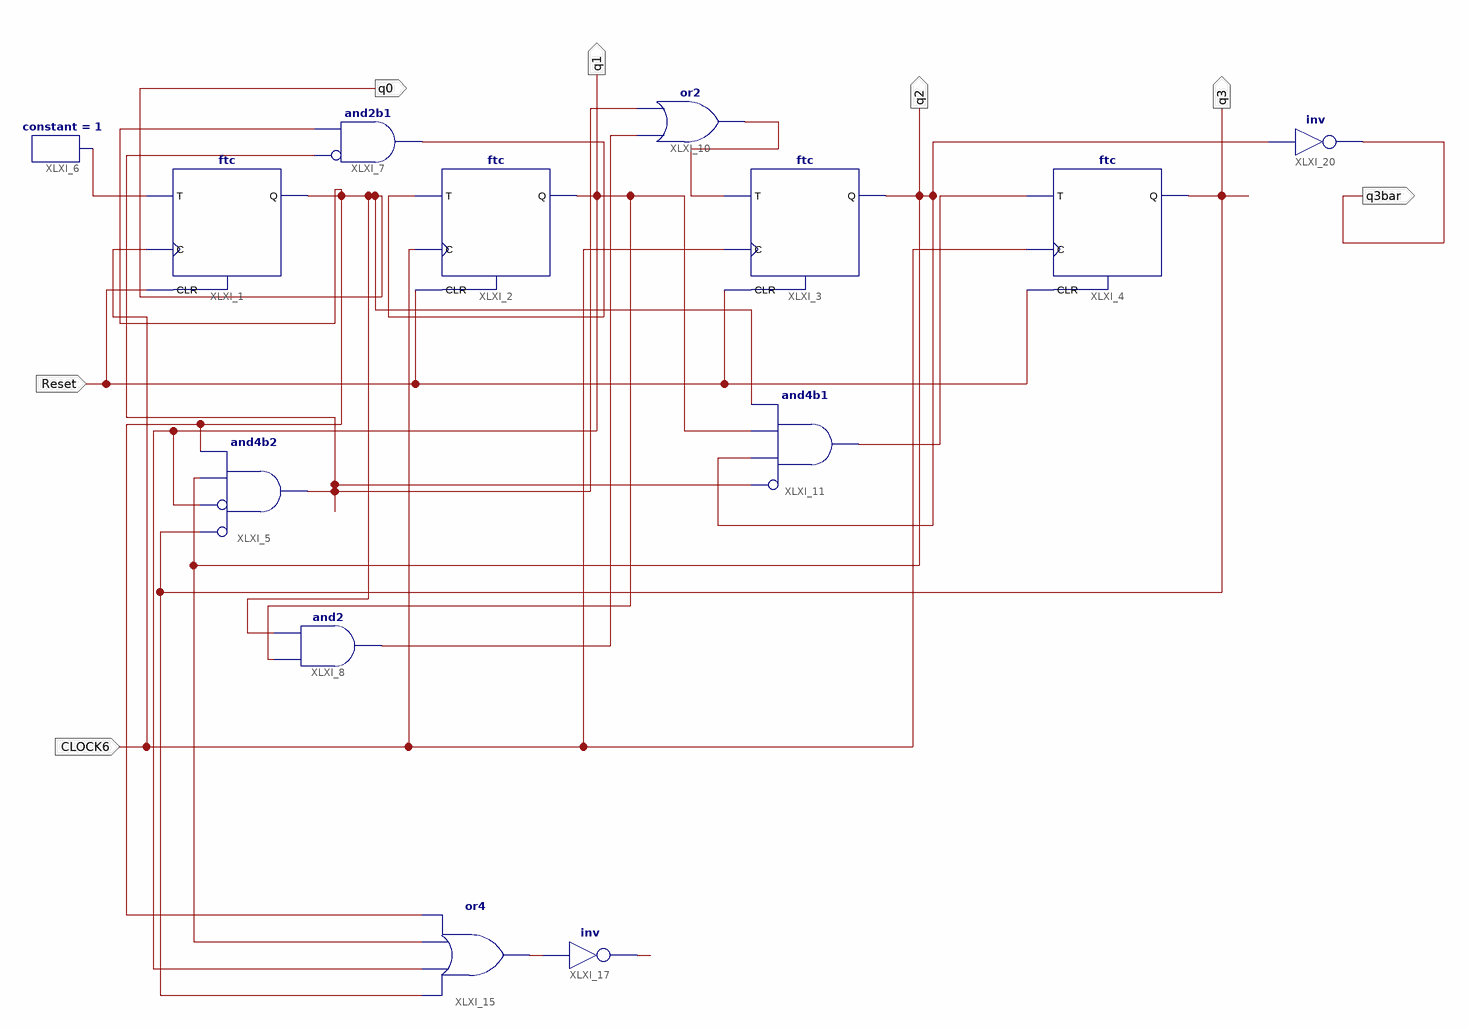
[diagram p0: schematic sheet 1]
// Xilinx ISE schematic Modulo6.sch (spartan6) as structural Verilog: 13 symbols, 7 ports
module Modulo6 (
  input  CLOCK6,
  input  Reset,
  output q1,
  output q2,
  output q3,
  output q0,
  output q3bar
);

  wire EoC6, EOC666, XLXN_5, XLXN_8, XLXN_11, XLXN_12, XLXN_14, XLXN_23;

  ftc XLXI_1 (.C(CLOCK6), .CLR(Reset), .T(XLXN_5), .Q(q0));
  ftc XLXI_2 (.C(CLOCK6), .CLR(Reset), .T(XLXN_8), .Q(q1));
  ftc XLXI_3 (.C(CLOCK6), .CLR(Reset), .T(XLXN_12), .Q(q2));
  ftc XLXI_4 (.C(CLOCK6), .CLR(Reset), .T(XLXN_14), .Q(q3));
  and XLXI_5 (EoC6, ~q3, ~q1, q2, q0);  // and4b2
  constant #(.CValue("1")) XLXI_6 (.O(XLXN_5));
  and XLXI_7 (XLXN_8, ~EoC6, q0);  // and2b1
  and XLXI_8 (XLXN_11, q1, q0);
  or XLXI_10 (XLXN_12, XLXN_11, EoC6);
  and XLXI_11 (XLXN_14, ~EoC6, q2, q1, q0);  // and4b1
  or XLXI_15 (XLXN_23, q3, q1, q2, q0);
  not XLXI_17 (EOC666, XLXN_23);
  not XLXI_20 (q3bar, q2);
endmodule
